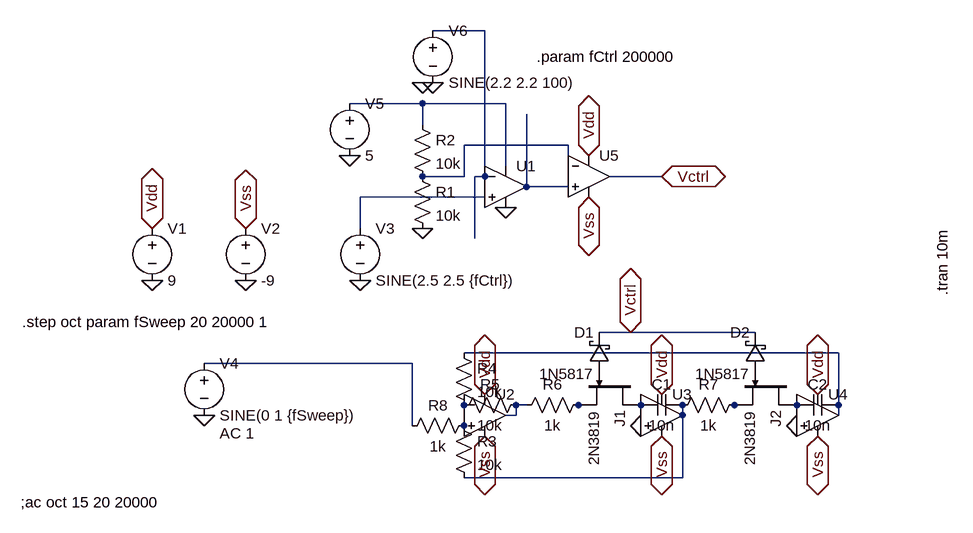
[diagram p0: schematic PWMsvf.asc]
PWMsvf.asc, the LTspice schematic file:
Version 4
SHEET 1 1236 680
WIRE 464 -256 384 -256
WIRE 368 -144 256 -144
WIRE 496 -144 368 -144
WIRE 368 -112 368 -144
WIRE 592 -80 432 -80
WIRE 496 -48 496 -144
WIRE 592 -48 592 -80
WIRE 432 -32 432 -80
WIRE 432 -32 368 -32
WIRE 464 -32 464 -256
WIRE 464 -32 448 -32
WIRE 736 -32 656 -32
WIRE 528 -16 528 -128
WIRE 592 -16 528 -16
WIRE 464 0 272 0
WIRE 272 48 272 0
WIRE 448 64 448 -32
WIRE 688 208 640 208
WIRE 880 208 688 208
WIRE 1008 240 432 240
WIRE 352 256 32 256
WIRE 528 320 512 320
WIRE 624 320 608 320
WIRE 864 320 848 320
WIRE 1008 320 1008 240
WIRE 512 336 512 320
WIRE 512 336 496 336
WIRE 768 336 768 320
WIRE 1008 336 1008 320
WIRE 352 352 352 256
WIRE 768 432 768 336
WIRE 768 432 432 432
FLAG 32 336 0
FLAG 272 128 0
FLAG 96 128 0
FLAG -48 128 0
FLAG 368 48 0
FLAG 256 -64 0
FLAG 496 16 0
FLAG -48 48 Vdd
IOPIN -48 48 BiDir
FLAG 96 48 Vss
IOPIN 96 48 BiDir
FLAG 736 -32 Vctrl
IOPIN 736 -32 BiDir
FLAG 464 304 Vdd
IOPIN 464 304 BiDir
FLAG 464 368 Vss
IOPIN 464 368 BiDir
FLAG 736 304 Vdd
IOPIN 736 304 BiDir
FLAG 736 368 Vss
IOPIN 736 368 BiDir
FLAG 976 304 Vdd
IOPIN 976 304 BiDir
FLAG 976 368 Vss
IOPIN 976 368 BiDir
FLAG 704 352 0
FLAG 944 352 0
FLAG 688 208 Vctrl
IOPIN 688 208 BiDir
FLAG 624 -64 Vdd
IOPIN 624 -64 BiDir
FLAG 624 0 Vss
IOPIN 624 0 BiDir
FLAG 368 -176 0
FLAG 384 -176 0
SYMBOL voltage -48 32 R0
WINDOW 123 0 0 Left 0
WINDOW 39 0 0 Left 0
SYMATTR InstName V1
SYMATTR Value 9
SYMBOL voltage 96 32 R0
WINDOW 123 0 0 Left 0
WINDOW 39 0 0 Left 0
SYMATTR InstName V2
SYMATTR Value -9
SYMBOL voltage 272 32 R0
WINDOW 123 0 0 Left 0
WINDOW 39 0 0 Left 0
SYMATTR InstName V3
SYMATTR Value SINE(2.5 2.5 {fCtrl})
SYMBOL voltage 32 240 R0
WINDOW 123 24 124 Left 2
WINDOW 39 0 0 Left 0
SYMATTR InstName V4
SYMATTR Value SINE(0 1 {fSweep})
SYMATTR Value2 AC 1
SYMBOL voltage 256 -160 R0
WINDOW 123 0 0 Left 0
WINDOW 39 0 0 Left 0
SYMATTR InstName V5
SYMATTR Value 5
SYMBOL res 352 -48 R0
SYMATTR InstName R1
SYMATTR Value 10k
SYMBOL res 352 -128 R0
SYMATTR InstName R2
SYMATTR Value 10k
SYMBOL Opamps\\UniversalOpamp2 496 -16 R0
SYMATTR InstName U1
SYMBOL Opamps\\UniversalOpamp2 464 336 R0
SYMATTR InstName U2
SYMBOL Opamps\\UniversalOpamp2 736 336 R0
SYMATTR InstName U3
SYMBOL Opamps\\UniversalOpamp2 976 336 R0
SYMATTR InstName U4
SYMBOL res 416 336 R0
SYMATTR InstName R3
SYMATTR Value 10k
SYMBOL res 416 224 R0
SYMATTR InstName R4
SYMATTR Value 10k
SYMBOL res 528 304 R90
WINDOW 0 0 56 VBottom 2
WINDOW 3 32 56 VTop 2
SYMATTR InstName R5
SYMATTR Value 10k
SYMBOL res 448 336 R90
WINDOW 0 0 56 VBottom 2
WINDOW 3 32 56 VTop 2
SYMATTR InstName R8
SYMATTR Value 1k
SYMBOL cap 768 304 R90
WINDOW 0 0 32 VBottom 2
WINDOW 3 32 32 VTop 2
SYMATTR InstName C1
SYMATTR Value 10n
SYMBOL cap 1008 304 R90
WINDOW 0 0 32 VBottom 2
WINDOW 3 32 32 VTop 2
SYMATTR InstName C2
SYMATTR Value 10n
SYMBOL njf 944 272 R90
SYMATTR InstName J2
SYMATTR Value 2N3819
SYMBOL njf 704 272 R90
SYMATTR InstName J1
SYMATTR Value 2N3819
SYMBOL schottky 656 272 R180
WINDOW 0 24 64 Left 2
WINDOW 3 24 0 Left 2
SYMATTR InstName D1
SYMATTR Value 1N5817
SYMATTR Description Diode
SYMATTR Type diode
SYMBOL schottky 896 272 R180
WINDOW 0 24 64 Left 2
WINDOW 3 24 0 Left 2
SYMATTR InstName D2
SYMATTR Value 1N5817
SYMATTR Description Diode
SYMATTR Type diode
SYMBOL Opamps\\UniversalOpamp2 624 -32 R0
SYMATTR InstName U5
SYMBOL res 624 304 R90
WINDOW 0 0 56 VBottom 2
WINDOW 3 32 56 VTop 2
SYMATTR InstName R6
SYMATTR Value 1k
SYMBOL res 864 304 R90
WINDOW 0 0 56 VBottom 2
WINDOW 3 32 56 VTop 2
SYMATTR InstName R7
SYMATTR Value 1k
SYMBOL voltage 384 -272 R0
WINDOW 123 0 0 Left 0
WINDOW 39 0 0 Left 0
SYMATTR InstName V6
SYMATTR Value SINE(2.2 2.2 100)
TEXT -248 192 Left 2 !.step oct param fSweep 20 20000 1
TEXT 544 -216 Left 2 !.param fCtrl 200000
TEXT -250 470 Left 2 !;ac oct 15 20 20000
TEXT 1168 152 VLeft 2 !.tran 10m

The netlist it stands for:
* PWMsvf.asc
V1 Vdd 0 9
V2 Vss 0 -9
V3 N005 0 SINE(2.5 2.5 {fCtrl})
V4 N007 0 SINE(0 1 {fSweep}) AC 1
V5 N002 0 5
R1 N003 0 10k
R2 N002 N003 10k
XU1 N005 N001 N002 0 N004 level.2 Avol=1Meg GBW=10Meg Slew=10Meg ilimit=25m rail=0 Vos=0 phimargin=45 en=0 enk=0 in=0 ink=0 Rin=500Meg  ; pins IN+ IN- V+ V- OUT
XU2 P001 P002 Vdd Vss N008 level.2 Avol=1Meg GBW=10Meg Slew=10Meg ilimit=25m rail=0 Vos=0 phimargin=45 en=0 enk=0 in=0 ink=0 Rin=500Meg  ; pins IN+ IN- V+ V- OUT
XU3 0 P003 Vdd Vss N011 level.2 Avol=1Meg GBW=10Meg Slew=10Meg ilimit=25m rail=0 Vos=0 phimargin=45 en=0 enk=0 in=0 ink=0 Rin=500Meg  ; pins IN+ IN- V+ V- OUT
XU4 0 P004 Vdd Vss N006 level.2 Avol=1Meg GBW=10Meg Slew=10Meg ilimit=25m rail=0 Vos=0 phimargin=45 en=0 enk=0 in=0 ink=0 Rin=500Meg  ; pins IN+ IN- V+ V- OUT
R3 P001 N011 10k
R4 N006 P002 10k
R5 N008 P002 10k
R8 P001 N007 1k
C1 N011 P003 10n
C2 N006 P004 10n
J2 P004 P005 N010 2N3819
J1 P003 P006 N009 2N3819
D1 P006 Vctrl 1N5817
D2 P005 Vctrl 1N5817
XU5 N004 N003 Vdd Vss Vctrl level.2 Avol=1Meg GBW=10Meg Slew=10Meg ilimit=25m rail=0 Vos=0 phimargin=45 en=0 enk=0 in=0 ink=0 Rin=500Meg  ; pins IN+ IN- V+ V- OUT
R6 N009 N008 1k
R7 N010 N011 1k
V6 N001 0 SINE(2.2 2.2 100)
.model D D
.lib standard.dio
.model NJF NJF
.model PJF PJF
.lib standard.jft
.step oct param fSweep 20 20000 1
.param fCtrl 200000
;ac oct 15 20 20000
.tran 10m
.lib UniversalOpamps2.sub
.backanno
.end